# EAGLE schematic mntrg_brd_esc (EAGLE 9.5.1)
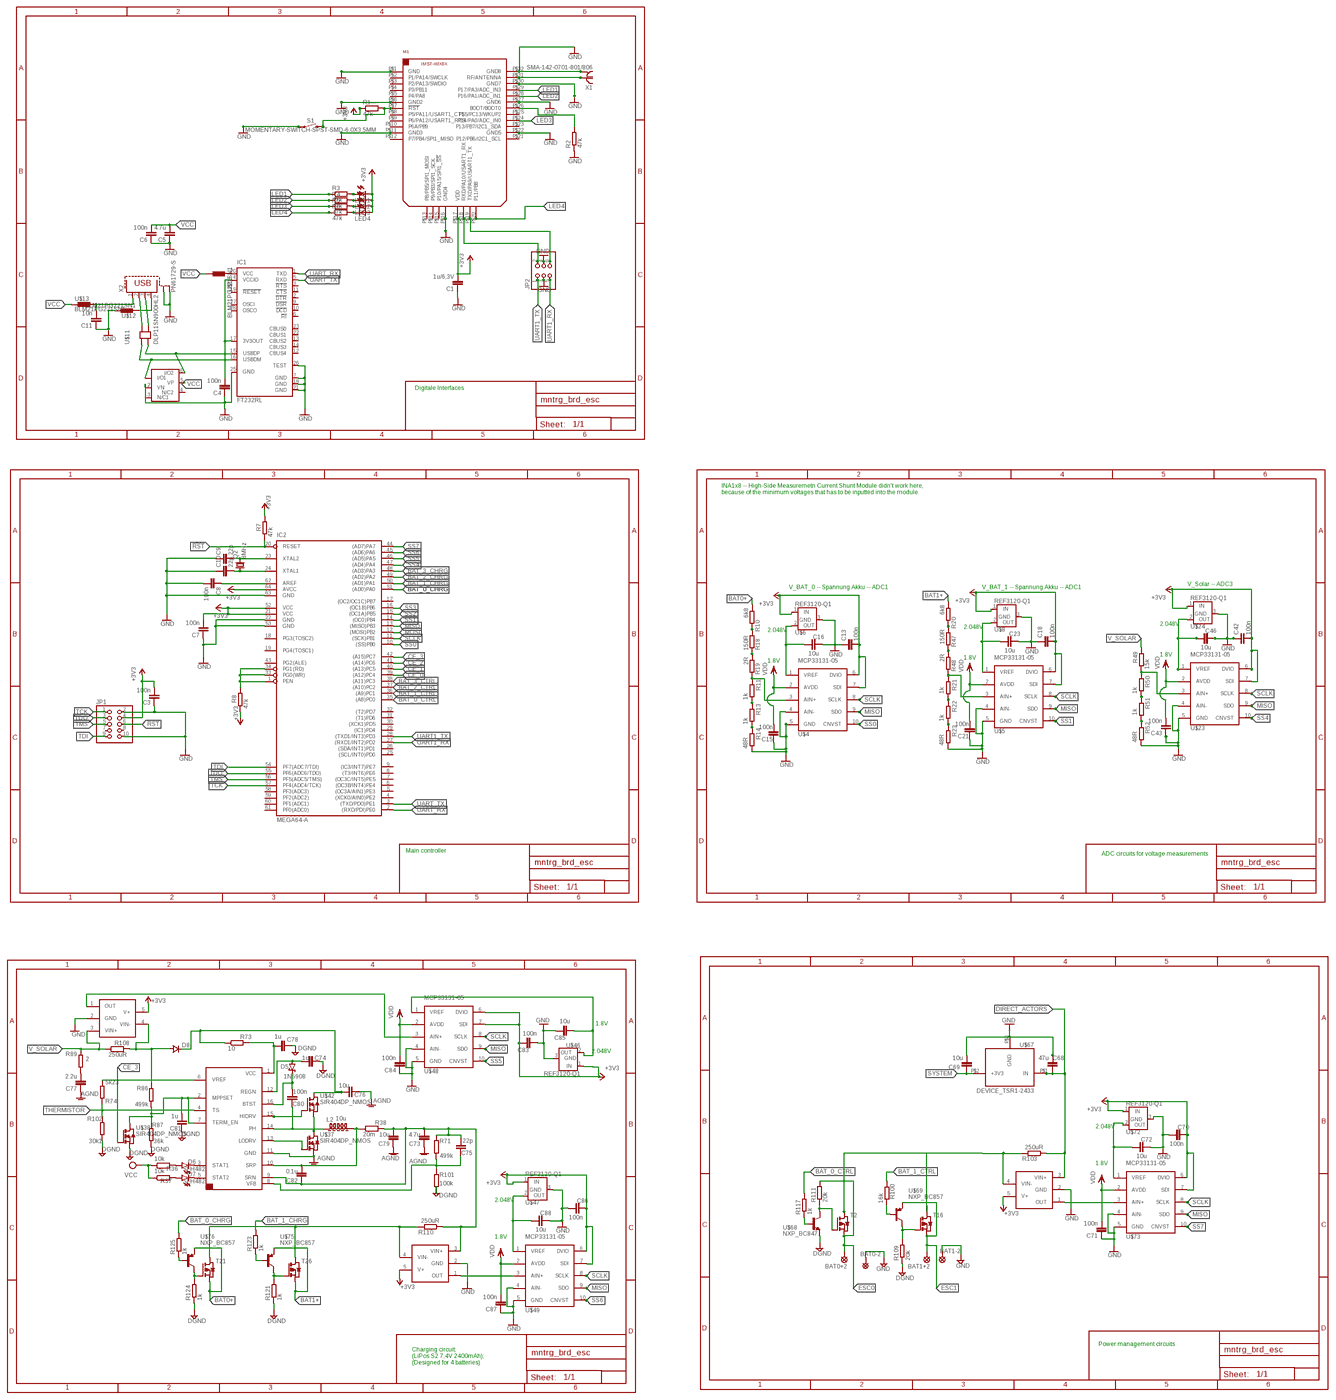
[diagram p0: schematic, sheet 1, overview]
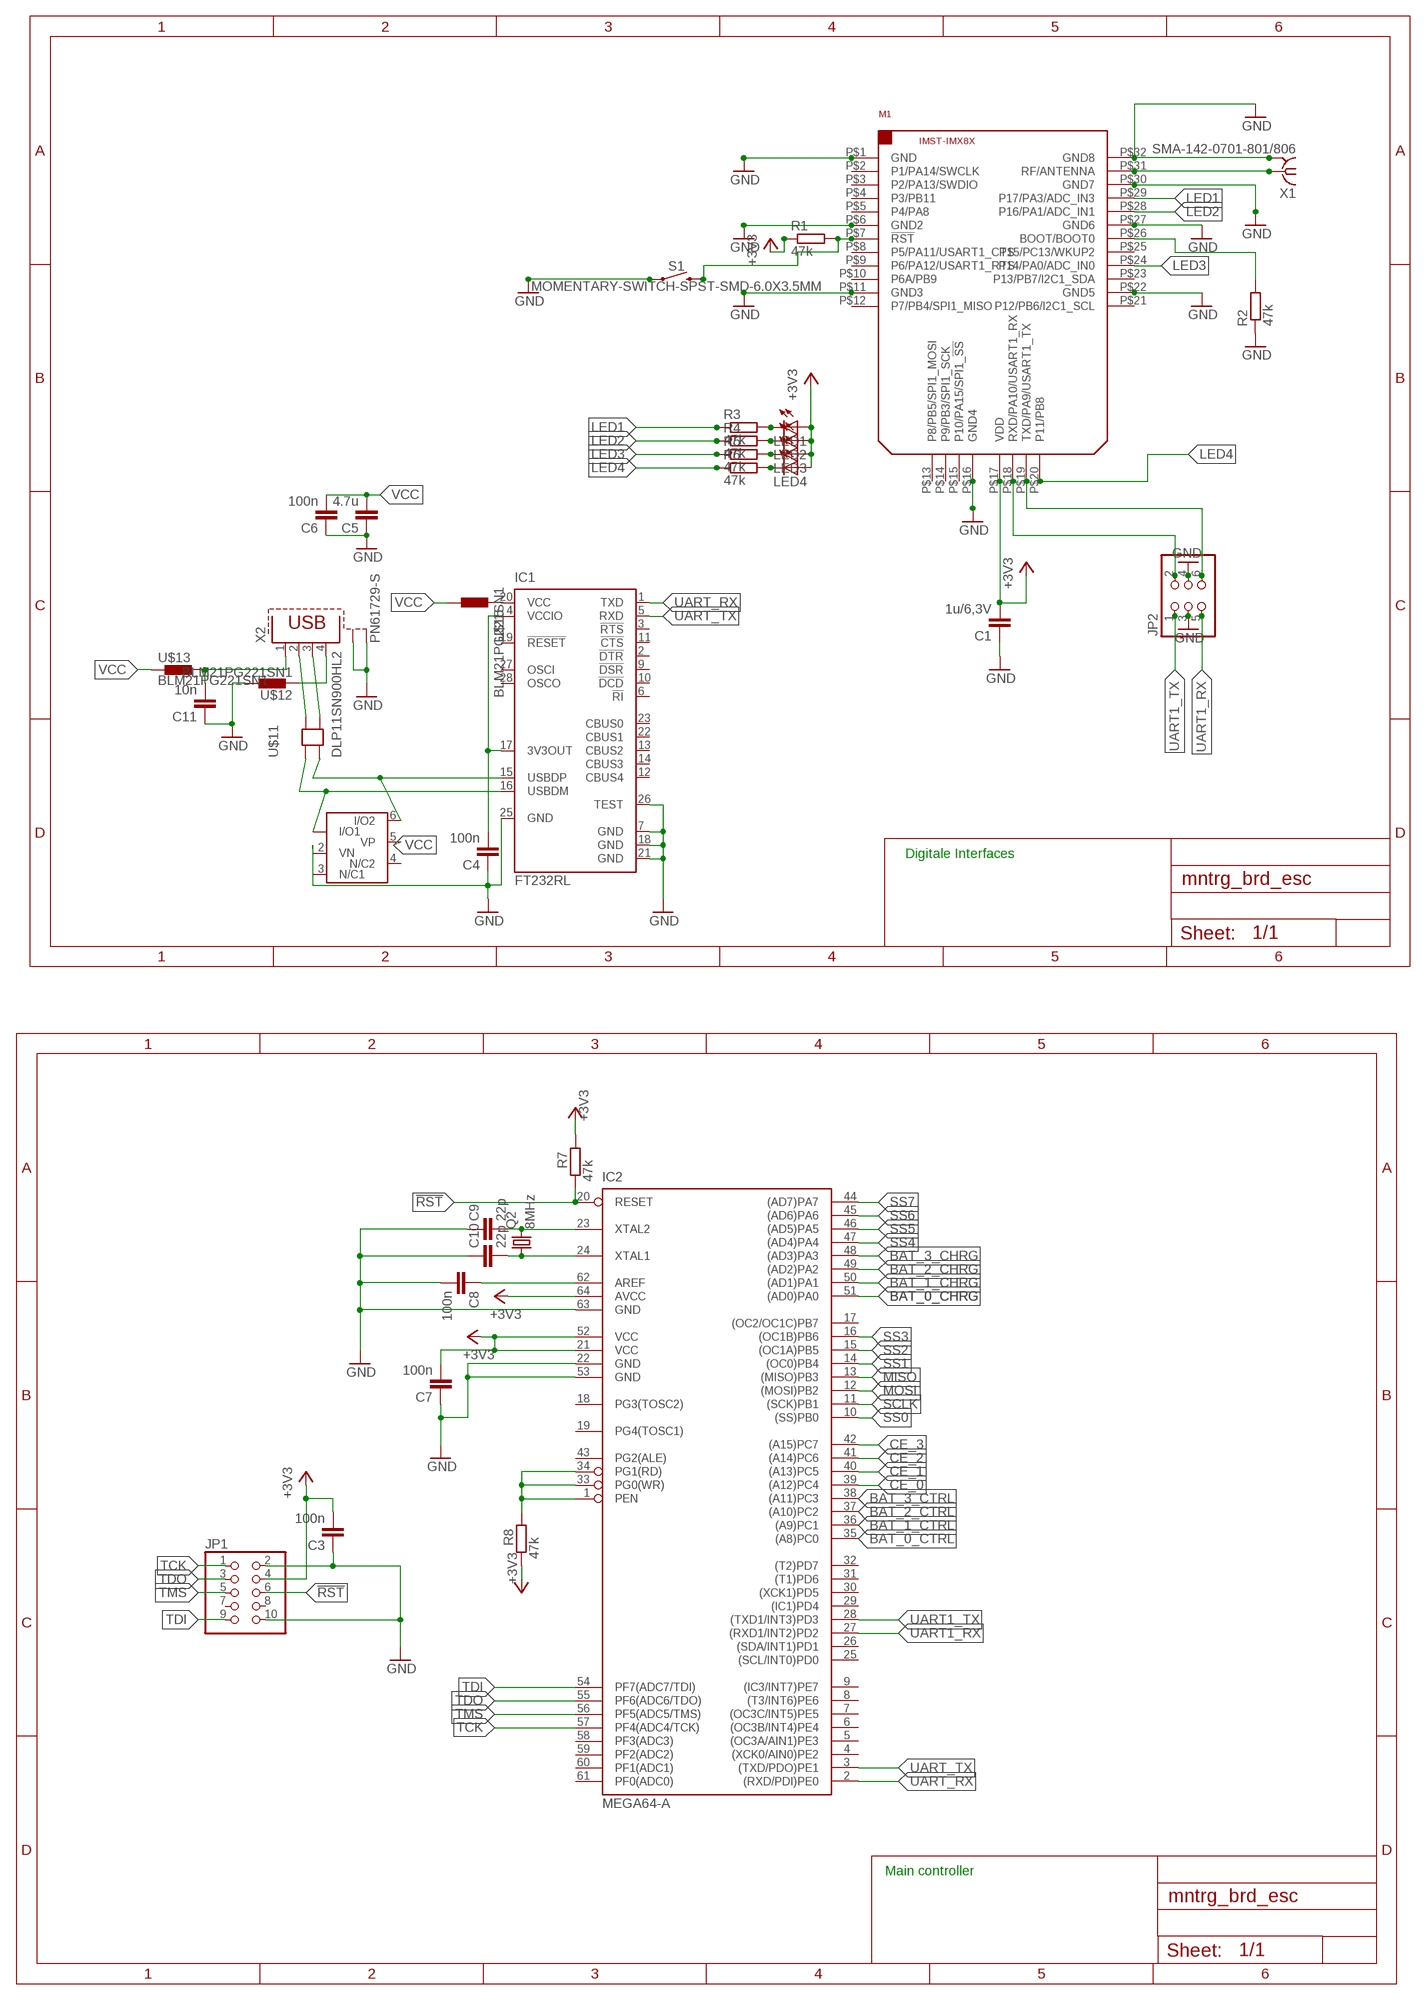
[diagram p1: schematic, sheet 1, part 1 of 4]
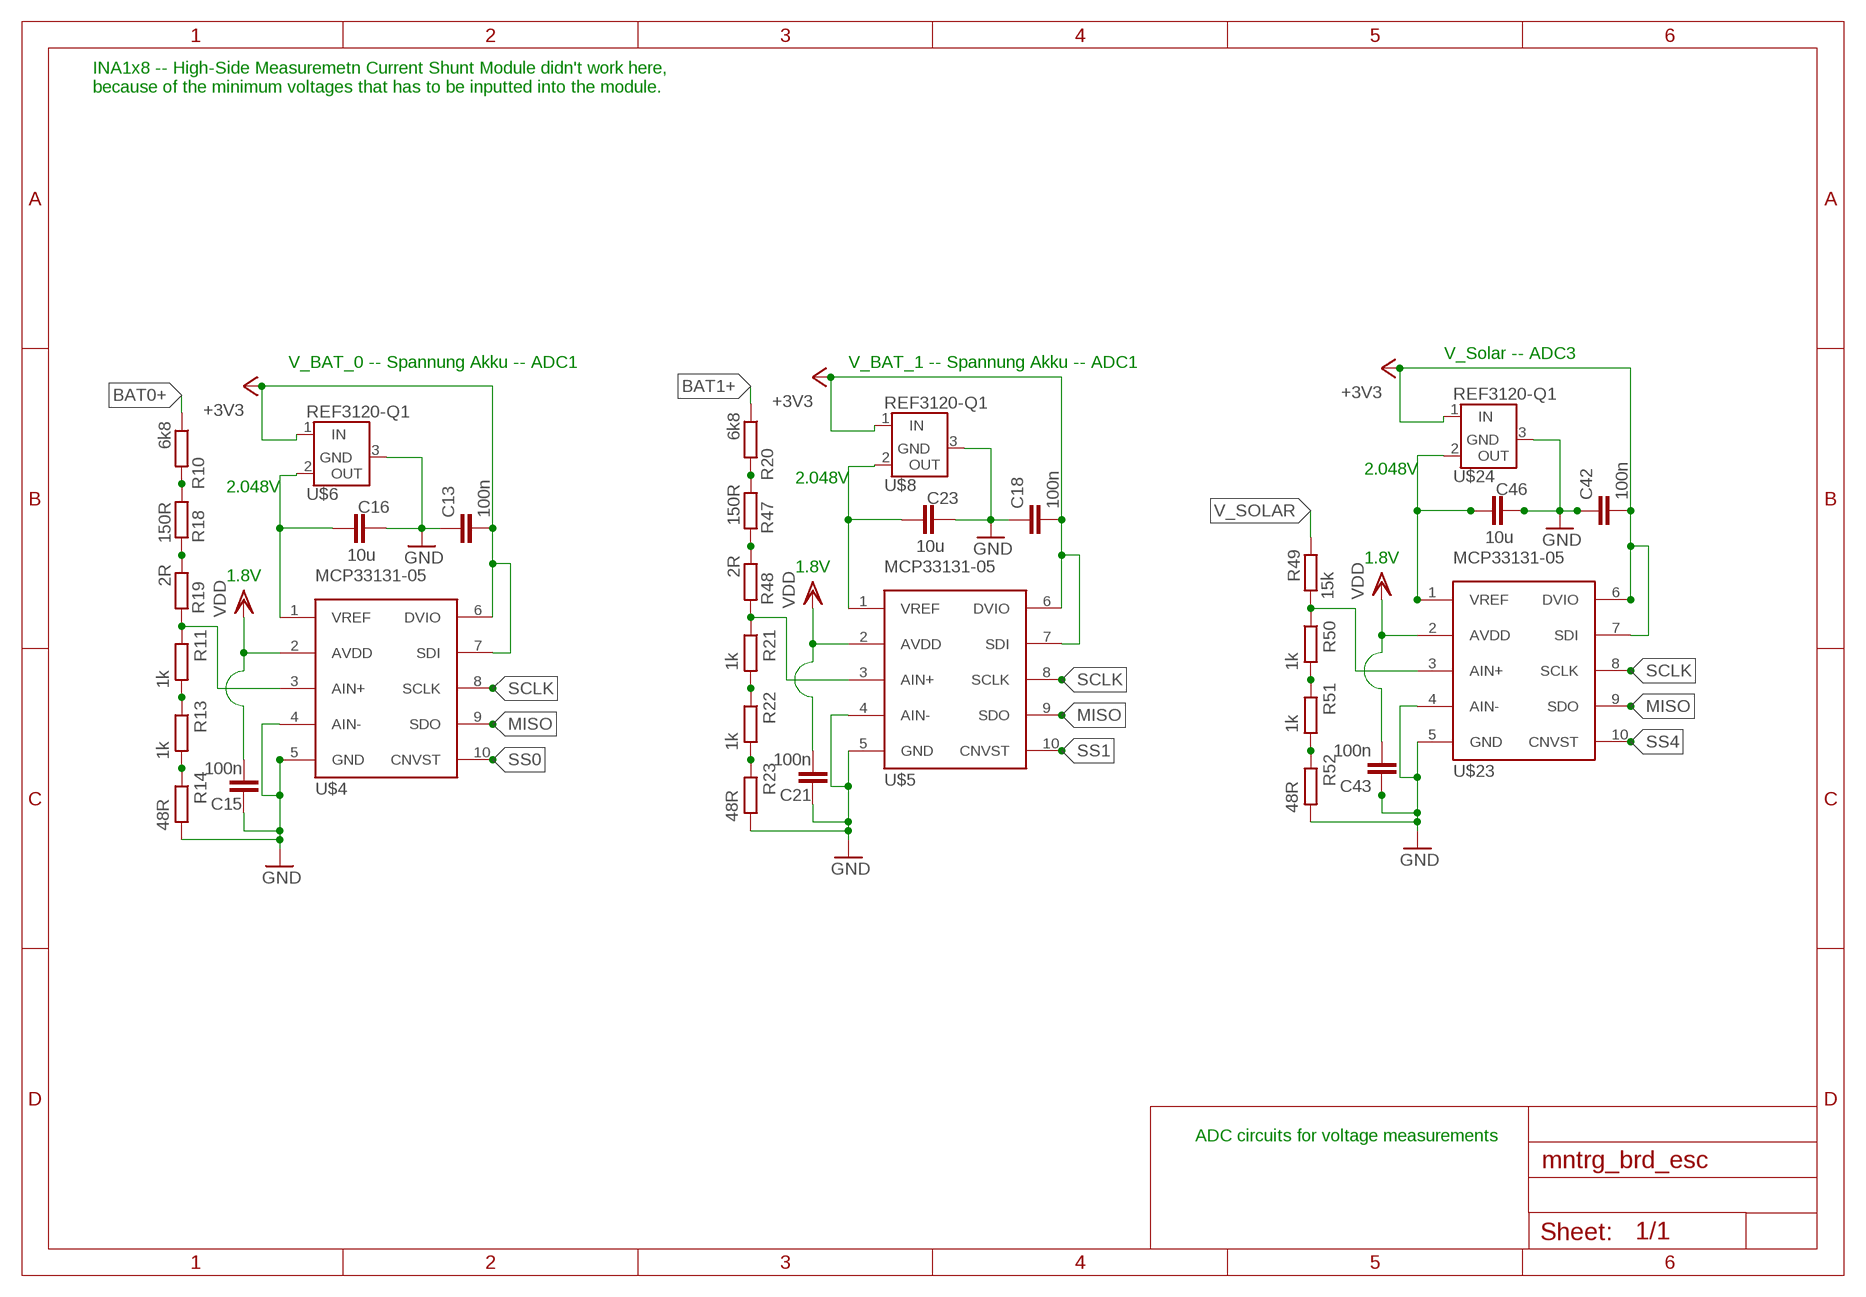
[diagram p2: schematic, sheet 1, part 2 of 4]
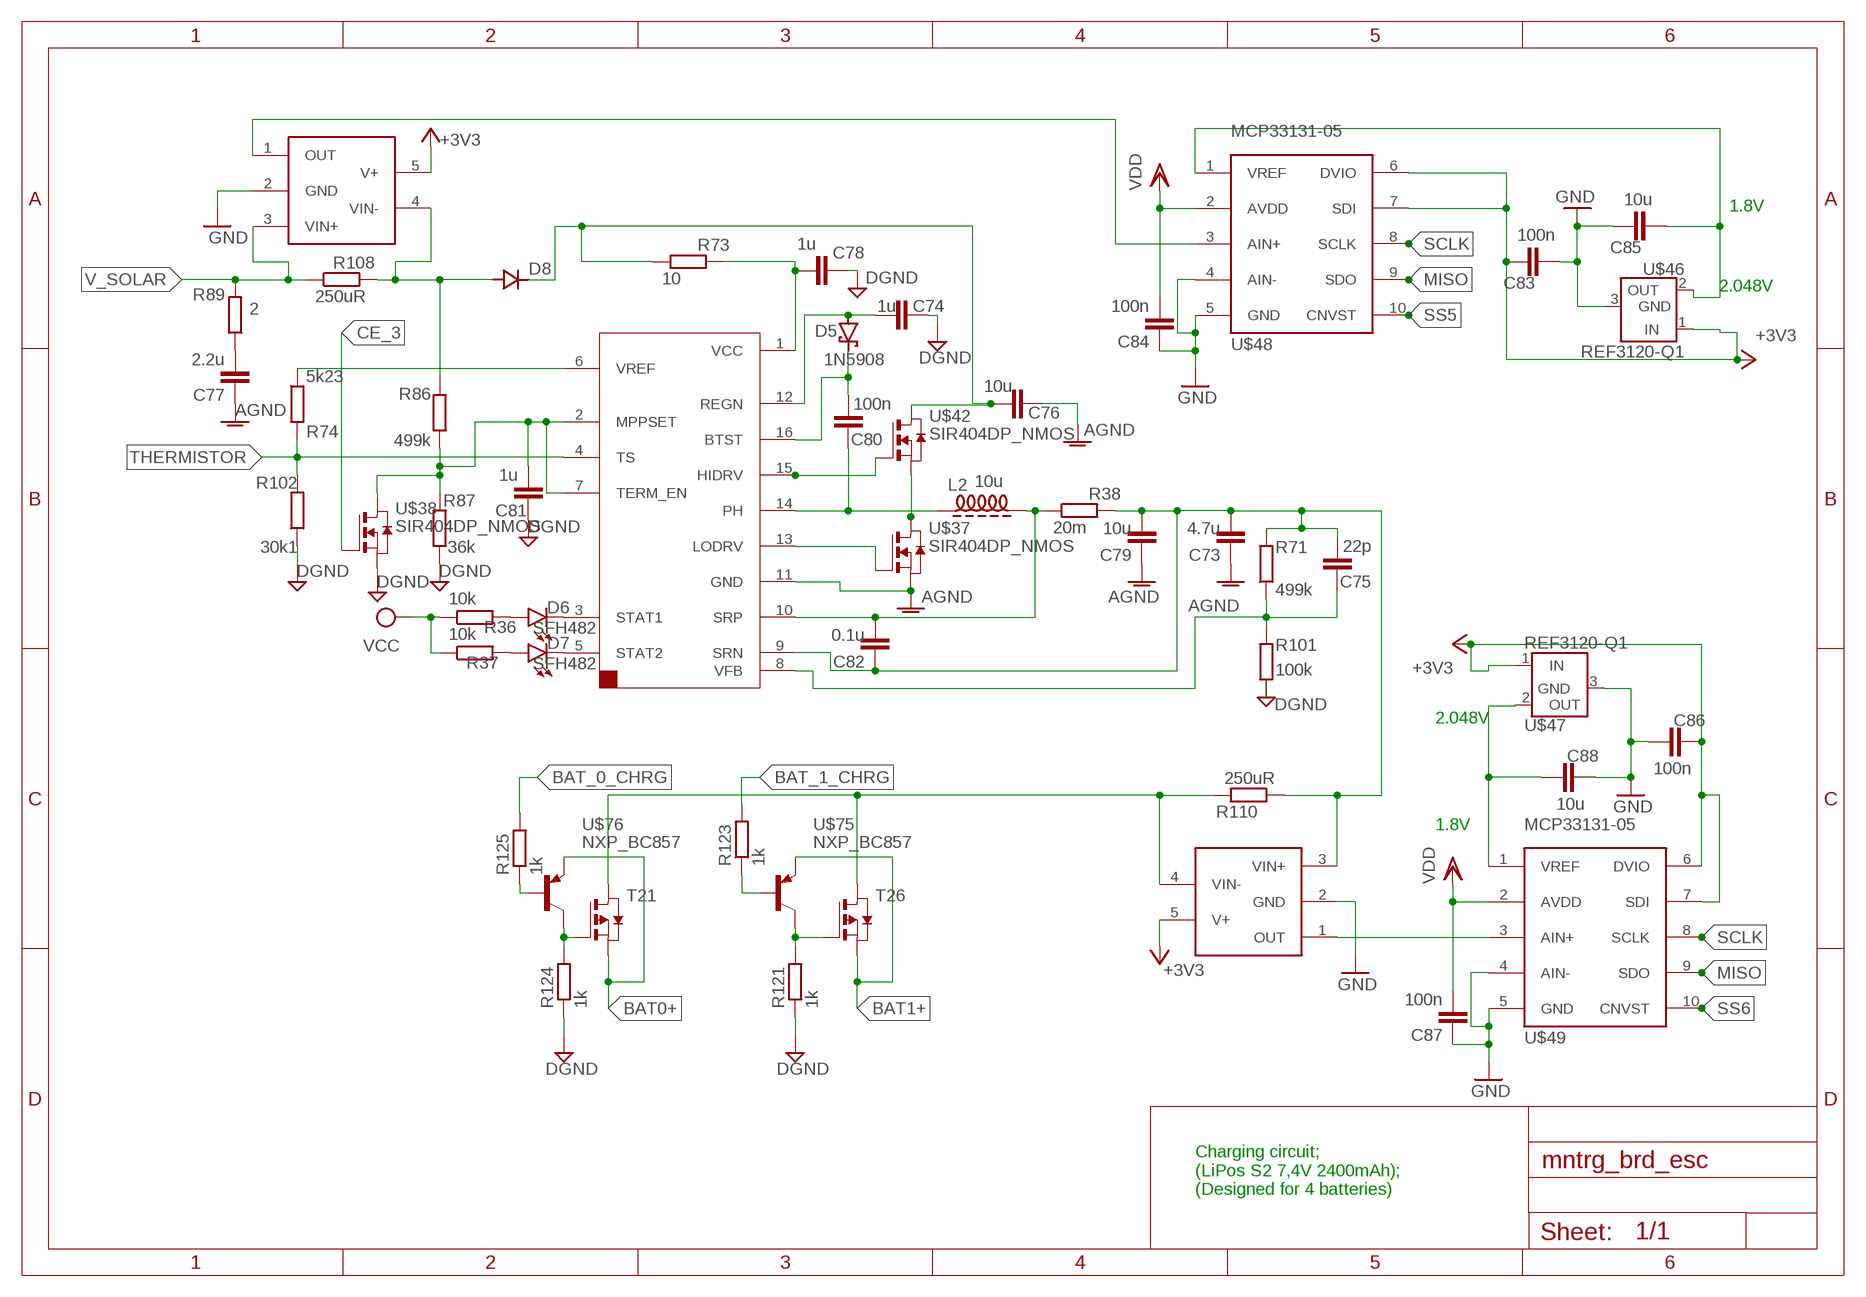
[diagram p3: schematic, sheet 1, part 3 of 4]
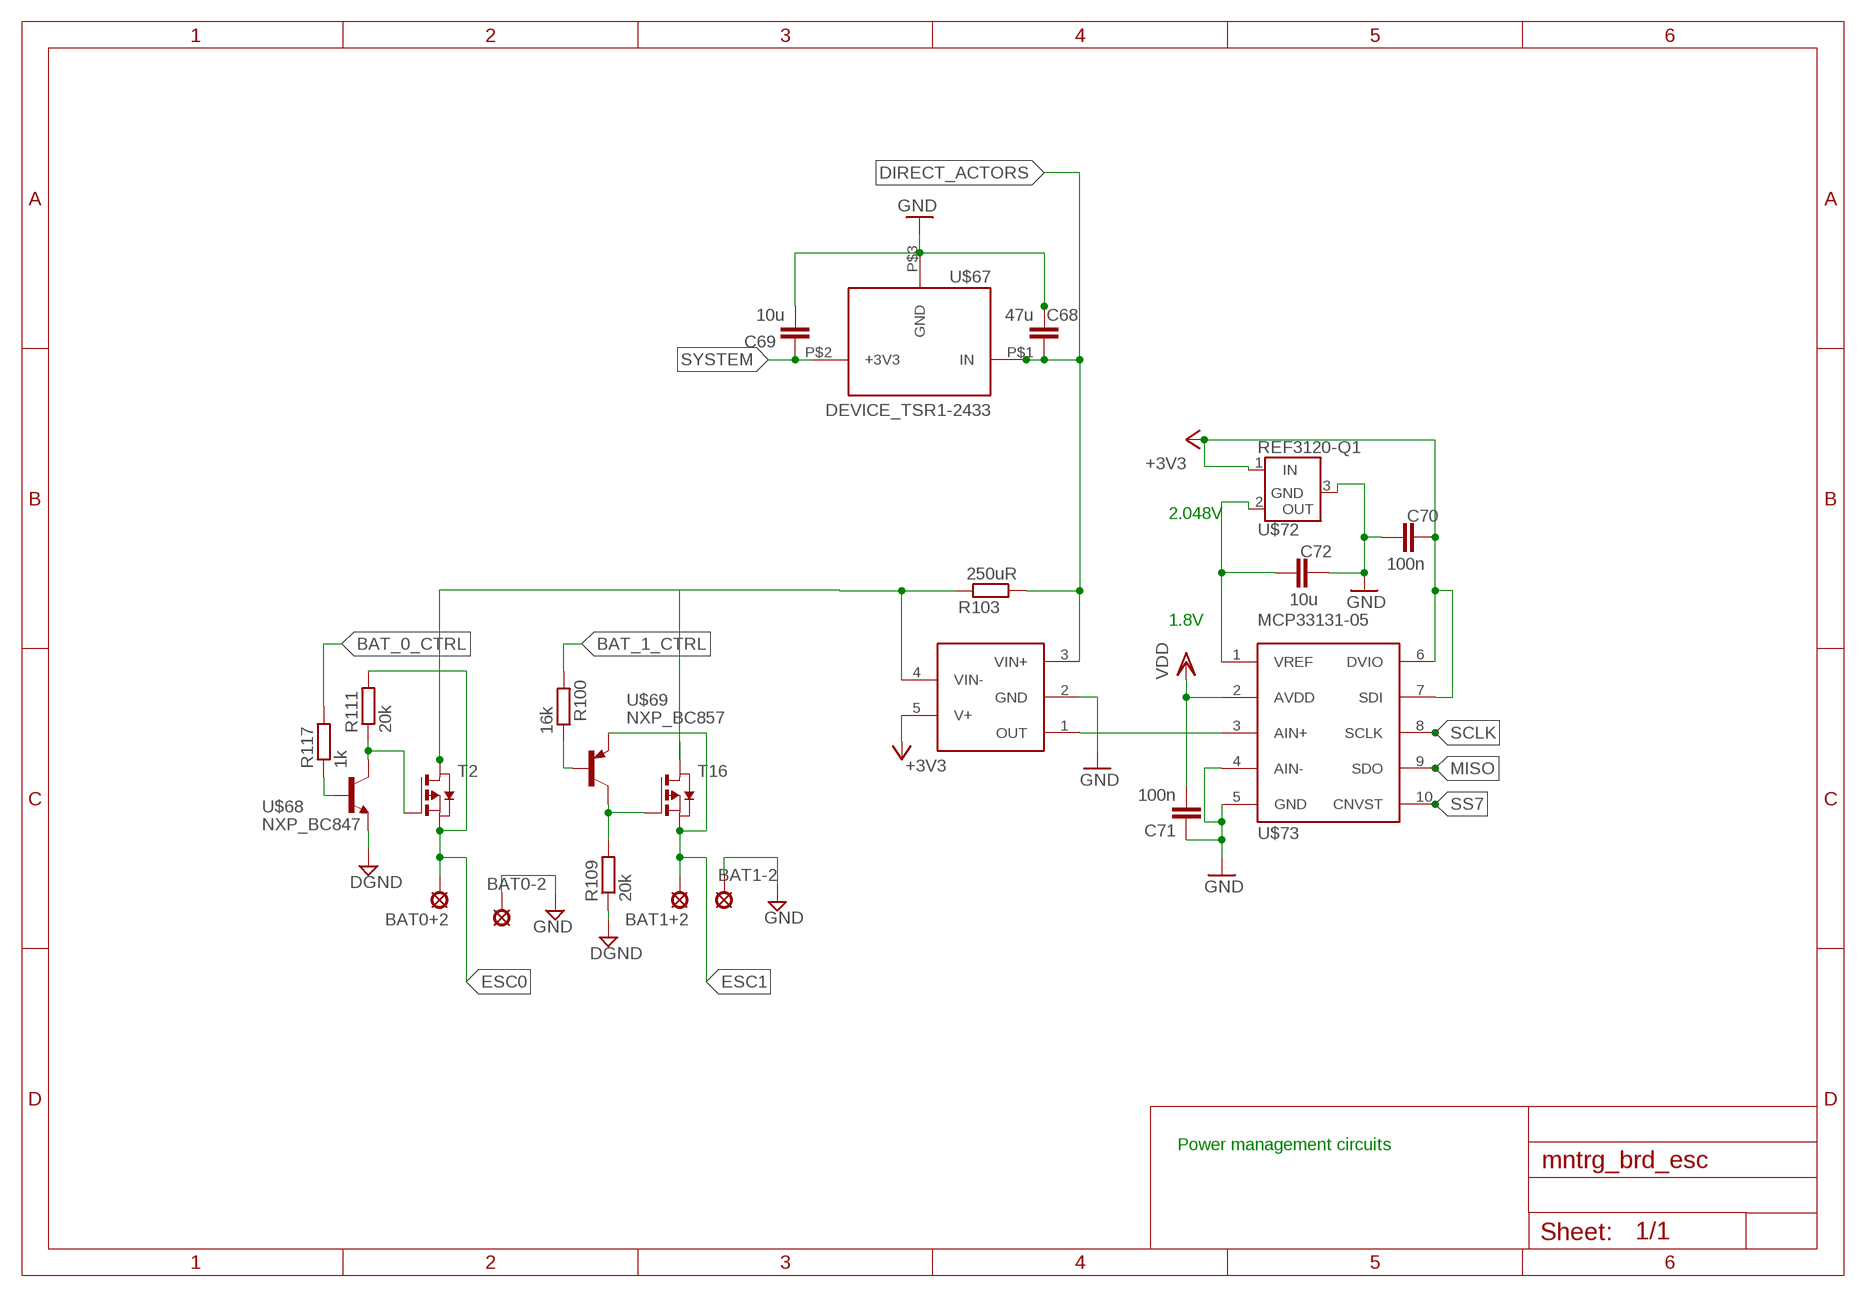
[diagram p4: schematic, sheet 1, part 4 of 4]

## Parts
BAT0+2  SE14  [SE14]
BAT0-2  SE14  [SE14]
BAT1+2  SE14  [SE14]
BAT1-2  SE14  [SE14]
C1  1u/6,3V  C-EUC0603  [C0603]
C3  100n  C-EUC0603  [C0603]
C4  100n  C-EUC0603  [C0603]
C5  4.7u  C-EUC0603  [C0603]
C6  100n  C-EUC0603  [C0603]
C7  100n  C-EUC0603  [C0603]
C8  100n  C-EUC0603  [C0603]
C9  22p  C-EUC0603  [C0603]
C10  22p  C-EUC0603  [C0603]
C11  10n  C-EUC0603  [C0603]
C13  100n  C-EUC0603  [C0603]
C15  100n  C-EUC0603  [C0603]
C16  10u  C-EUC0603  [C0603]
C18  100n  C-EUC0603  [C0603]
C21  100n  C-EUC0603  [C0603]
C23  10u  C-EUC0603  [C0603]
C42  100n  C-EUC0603  [C0603]
C43  100n  C-EUC0603  [C0603]
C46  10u  C-EUC0603  [C0603]
C68  47u  C-EUC1206  [C1206]
C69  10u  C-EUC1206  [C1206]
C70  100n  C-EUC0603  [C0603]
C71  100n  C-EUC0603  [C0603]
C72  10u  C-EUC0603  [C0603]
C73  4.7u  C-EUC0603  [C0603]
C74  1u  C-EUC0603  [C0603]
C75  22p  C-EUC0603  [C0603]
C76  10u  C-EUC0603  [C0603]
C77  2.2u  C-EUC0603  [C0603]
C78  1u  C-EUC0603  [C0603]
C79  10u  C-EUC0603  [C0603]
C80  100n  C-EUC0603  [C0603]
C81  1u  C-EUC0603  [C0603]
C82  0.1u  C-EUC0603  [C0603]
C83  100n  C-EUC0603  [C0603]
C84  100n  C-EUC0603  [C0603]
C85  10u  C-EUC0603  [C0603]
C86  100n  C-EUC0603  [C0603]
C87  100n  C-EUC0603  [C0603]
C88  10u  C-EUC0603  [C0603]
D5  1N5908  [C4111-15]
D6  SFH482  [SFH482]
D7  SFH482  [SFH482]
D8  VAR2SOT23  [SOT-23]
IC1  FT232RL  [SSOP28]
IC2  MEGA64-A  [TQFP64]
JP1  PINHD-2X5  [2X05]
JP2  PINHD-2X3  [2X03]
L2  10u  Z15/10CCW  [Z15/1]
LED1  LEDCHIP-LED0603  [CHIP-LED0603]
LED2  LEDCHIP-LED0603  [CHIP-LED0603]
LED3  LEDCHIP-LED0603  [CHIP-LED0603]
LED4  LEDCHIP-LED0603  [CHIP-LED0603]
M1  IM-X8X  [IM-X8X]
Q2  8MHz  CRYSTALHC49S  [HC49/S]
R1  47k  R-EU_R0603  [R0603]
R2  47k  R-EU_R0603  [R0603]
R3  47k  R-EU_R0603  [R0603]
R4  47k  R-EU_R0603  [R0603]
R5  47k  R-EU_R0603  [R0603]
R6  47k  R-EU_R0603  [R0603]
R7  47k  R-EU_R0603  [R0603]
R8  47k  R-EU_R0603  [R0603]
R10  6k8  R-EU_R0603  [R0603]
R11  1k  R-EU_R0603  [R0603]
R13  1k  R-EU_R0603  [R0603]
R14  48R  R-EU_R0603  [R0603]
R18  150R  R-EU_R0603  [R0603]
R19  2R  R-EU_R0603  [R0603]
R20  6k8  R-EU_R0603  [R0603]
R21  1k  R-EU_R0603  [R0603]
R22  1k  R-EU_R0603  [R0603]
R23  48R  R-EU_R0603  [R0603]
R36  10k  R-EU_R0603  [R0603]
R37  10k  R-EU_R0603  [R0603]
R38  20m  R-EU_R0603  [R0603]
R47  150R  R-EU_R0603  [R0603]
R48  2R  R-EU_R0603  [R0603]
R49  15k  R-EU_R0603  [R0603]
R50  1k  R-EU_R0603  [R0603]
R51  1k  R-EU_R0603  [R0603]
R52  48R  R-EU_R0603  [R0603]
R71  499k  R-EU_R0603  [R0603]
R73  10  R-EU_R0603  [R0603]
R74  5k23  R-EU_R0603  [R0603]
R86  499k  R-EU_R0603  [R0603]
R87  36k  R-EU_R0603  [R0603]
R89  2  R-EU_R0603  [R0603]
R100  16k  R-EU_R0603  [R0603]
R101  100k  R-EU_R0603  [R0603]
R102  30k1  R-EU_R0603  [R0603]
R103  250uR  R-EU_R0603  [R0603]
R108  250uR  R-EU_R0603  [R0603]
R109  20k  R-EU_R0603  [R0603]
R110  250uR  R-EU_R0603  [R0603]
R111  20k  R-EU_R0603  [R0603]
R117  1k  R-EU_R0603  [R0603]
R121  1k  R-EU_R0603  [R0603]
R123  1k  R-EU_R0603  [R0603]
R124  1k  R-EU_R0603  [R0603]
R125  1k  R-EU_R0603  [R0603]
S1  MOMENTARY-SWITCH-SPST-SMD-6.0X3.5MM  [TACTILE_SWITCH_SMD_6.0X3.5MM]
T2  SI7157DP_PMOS  [SI7157DP_PMOS]
T16  SI7157DP_PMOS  [SI7157DP_PMOS]
T21  SI7157DP_PMOS  [SI7157DP_PMOS]
T26  SI7157DP_PMOS  [SI7157DP_PMOS]
U$4  MCP33131-05  [MCP33131-05]
U$5  MCP33131-05  [MCP33131-05]
U$6  REF3120-Q1  [REF3120-Q1]
U$8  REF3120-Q1  [REF3120-Q1]
U$11  DLP11SN900HL2  [DLP11SN900HL2]
U$12  BLM21PG221SN1  [BLM21PG221SN1]
U$13  BLM21PG221SN1  [BLM21PG221SN1]
U$14  DUP2201MR6  [NUP2201MR6]
U$15  BLM21PG221SN1  [BLM21PG221SN1]
U$23  MCP33131-05  [MCP33131-05]
U$24  REF3120-Q1  [REF3120-Q1]
U$36  BQ24650  [BQ24650]
U$37  SIR404DP_NMOS  [SIR404DP_NMOS]
U$38  SIR404DP_NMOS  [SIR404DP_NMOS]
U$42  SIR404DP_NMOS  [SIR404DP_NMOS]
U$46  REF3120-Q1  [REF3120-Q1]
U$47  REF3120-Q1  [REF3120-Q1]
U$48  MCP33131-05  [MCP33131-05]
U$49  MCP33131-05  [MCP33131-05]
U$50  INA138  [INA138]
U$51  INA138  [INA138]
U$67  DEVICE_TSR1-2433  [FOOTPRINT_TSR1-2344]
U$68  NXP_BC847  [NXP_BC847]
U$69  NXP_BC857  [NXP_BC857]
U$72  REF3120-Q1  [REF3120-Q1]
U$73  MCP33131-05  [MCP33131-05]
U$74  INA138  [INA138]
U$75  NXP_BC857  [NXP_BC857]
U$76  NXP_BC857  [NXP_BC857]
X1  SMA-142-0701-801/806  [J502-ND-142-0701-801/806]
X2  PN61729-S  [PN61729-S]

## Nets
!RST: IC2.20(RESET) R7.1
+3V3: C1.2 C3.2 C7.2 C13.2 C18.2 C42.2 C70.2 C83.2 C86.2 IC2.21(VCC) IC2.52(VCC) IC2.64(AVCC) JP1.4 LED1.A LED2.A LED3.A LED4.A M1.P$17(VDD) R1.1 R7.2 R8.1 U$4.6(DVIO) U$4.7(SDI) U$5.6(DVIO) U$5.7(SDI) U$6.1(IN) U$8.1(IN) U$23.6(DVIO) U$23.7(SDI) U$24.1(IN) U$46.1(IN) U$47.1(IN) U$48.6(DVIO) U$48.7(SDI) U$49.6(DVIO) U$49.7(SDI) U$50.5(V+) U$51.5(V+) U$72.1(IN) U$73.6(DVIO) U$73.7(SDI) U$74.5(V+)
AGND: C73.1 C76.1 C77.1 C79.1 U$36.11(GND) U$37.1(S) U$37.2(S) U$37.3(S)
BAT0+: R10.1 T21.1(S) T21.2(S) T21.3(S) U$76.2(E)
BAT1+: R20.1 T26.1(S) T26.2(S) T26.3(S) U$75.2(E)
BAT_0_CHRG: IC2.51((AD0)PA0) R125.2
BAT_0_CTRL: R117.2
BAT_1_CHRG: IC2.50((AD1)PA1) R123.2
BAT_1_CTRL: R100.2
BAT_2_CHRG: IC2.49((AD2)PA2)
BAT_3_CHRG: IC2.48((AD3)PA3)
BATTERY2: C73.2 C75.2 C79.2 C82.1 R38.2 R71.2 R110.1 U$36.9(SRN) U$50.3(VIN+)
CE_0: IC2.39((A12)PC4)
CE_1: IC2.40((A13)PC5)
CE_2: IC2.41((A14)PC6)
CE_3: U$38.4(G)
DGND: C74.1 C78.1 C81.1 R87.1 R101.1 R102.1 R109.1 R121.1 R124.1 U$38.1(S) U$38.2(S) U$38.3(S) U$68.2(E)
DIRECT_ACTORS: C68.1 R103.1 U$67.P$1(IN) U$74.3(VIN+)
ESC0: BAT0+2.MP R111.2 T2.1(S) T2.2(S) T2.3(S)
ESC1: BAT1+2.MP T16.1(S) T16.2(S) T16.3(S) U$69.2(E)
GND: BAT0-2.MP BAT1-2.MP C1.1 C3.1 C4.1 C5.1 C6.1 C7.1 C8.2 C9.1 C10.1 C11.1 C13.1 C15.1 C16.2 C18.1 C21.1 C23.2 C42.1 C46.2 C68.2 C69.2 C70.1 C71.1 C72.2 C83.1 C84.1 C85.2 C86.1 C87.1 C88.2 IC1.7(GND) IC1.18(GND) IC1.21(GND) IC1.25(GND) IC1.26(TEST) IC2.22(GND) IC2.53(GND) IC2.63(GND) JP1.2 JP1.10 JP2.3 JP2.4 M1.P$1(GND) M1.P$6(GND2) M1.P$11(GND3) M1.P$16(GND4) M1.P$22(GND5) M1.P$27(GND6) M1.P$30(GND7) M1.P$32(GND8) R2.1 R14.2 R23.2 S1.1 U$4.4(AIN-) U$4.5(GND) U$5.4(AIN-) U$5.5(GND) U$6.3(GND) U$8.3(GND) U$12.2 U$14.2(VN) U$24.3(GND) U$46.3(GND) U$47.3(GND) U$48.4(AIN-) U$48.5(GND) U$49.4(AIN-) U$49.5(GND) U$50.2(GND) U$51.2(GND) U$67.P$3(GND) U$72.3(GND) U$73.4(AIN-) U$73.5(GND) U$74.2(GND) X1.G@1 X1.G@2 X1.G@3 X1.G@4 X2.S1 X2.S2
GND1: C43.1 R52.2 U$23.4(AIN-) U$23.5(GND) ; supply symbol labelled GND
LED1: M1.P$29(P17/PA3/ADC_IN3) R3.1
LED2: M1.P$28(P16/PA1/ADC_IN1) R4.1
LED3: M1.P$24(P14/PA0/ADC_IN0) R5.1
LED4: M1.P$20(P11/PB8) R6.1
MISO: IC2.13((MISO)PB3) U$4.9(SDO) U$5.9(SDO) U$23.9(SDO) U$48.9(SDO) U$49.9(SDO) U$73.9(SDO)
MOSI: IC2.12((MOSI)PB2)
N$1: M1.P$31(RF/ANTENNA) X1.1
N$2: LED1.C R3.2
N$3: M1.P$7(!RST) R1.2 S1.2
N$4: M1.P$26(BOOT/BOOT0) R2.2
N$5: LED2.C R4.2
N$6: LED3.C R5.2
N$7: LED4.C R6.2
N$8: IC2.54(PF7(ADC7/TDI))
N$9: IC2.55(PF6(ADC6/TDO))
N$10: IC2.56(PF5(ADC5/TMS))
N$11: IC2.57(PF4(ADC4/TCK))
N$12: C9.2 IC2.23(XTAL2) Q2.2
N$13: C10.2 IC2.24(XTAL1) Q2.1
N$14: C8.1 IC2.62(AREF)
N$15: JP1.6
N$16: IC2.1(PEN) IC2.33(PG0(WR)) IC2.34(PG1(RD)) R8.2
N$17: U$11.2 X2.2
N$18: U$11.4 X2.3
N$19: IC1.16(USBDM) U$11.1 U$14.1(I/O1)
N$20: IC1.15(USBDP) U$11.3 U$14.6(I/O2)
N$21: U$12.1 X2.4
N$22: C16.1 U$4.1(VREF) U$6.2(OUT)
N$23: R11.1 R19.2 U$4.3(AIN+)
N$24: R13.2 R14.1
N$25: C4.2 IC1.4(VCCIO) IC1.17(3V3OUT)
N$26: R11.2 R13.1
N$27: R10.2 R18.1
N$30: C11.2 U$13.2 X2.1
N$34: R18.2 R19.1
N$35: C23.1 U$5.1(VREF) U$8.2(OUT)
N$39: R21.1 R48.2 U$5.3(AIN+)
N$40: R22.2 R23.1
N$41: R21.2 R22.1
N$42: R20.2 R47.1
N$43: R47.2 R48.1
N$49: IC2.42((A15)PC7)
N$50: C77.2 R89.1
N$54: R74.1 U$36.6(VREF)
N$55: C81.2 R86.1 R87.2 U$36.2(MPPSET) U$36.7(TERM_EN)
N$73: D6.K(C) U$36.3(STAT1)
N$74: D7.K(C) U$36.5(STAT2)
N$75: D6.A R36.2
N$76: D7.A R37.2
N$86: C46.1 U$23.1(VREF) U$24.2(OUT)
N$91: R49.1 R50.1 U$23.3(AIN+)
N$95: R51.2 R52.1
N$96: R50.2 R51.1
N$112: C78.2 R73.2 U$36.1(VCC)
N$114: C74.2 D5.A U$36.12(REGN)
N$115: C80.1 L2.1 U$36.14(PH)
N$132: U$36.13(LODRV)
N$133: C82.2 L2.2 R38.1 U$36.10(SRP)
N$135: C80.2 D5.C U$36.16(BTST)
N$152: U$36.15(HIDRV) U$42.4(G)
N$153: C76.2 D8.1(C) R73.1 U$42.5(D) U$42.6(D) U$42.7(D) U$42.8(D)
N$154: C75.1 R71.1 R101.2 U$36.8(VFB)
N$164: C72.1 U$72.2(OUT) U$73.1(VREF)
N$165: U$73.3(AIN+) U$74.1(OUT)
N$166: R103.2 T2.5(D) T2.6(D) T2.7(D) T2.8(D) T16.5(D) T16.6(D) T16.7(D) T16.8(D) U$74.4(VIN-)
N$167: R111.1 T2.4(G) U$68.3(C)
N$168: R117.1 U$68.1(B)
N$169: R109.2 T16.4(G) U$69.3(C)
N$172: D8.3(A) R86.2 R108.2 U$51.4(VIN-)
N$173: U$38.5(D) U$38.6(D) U$38.7(D) U$38.8(D)
N$174: U$37.5(D) U$37.6(D) U$37.7(D) U$37.8(D) U$42.1(S) U$42.2(S) U$42.3(S)
N$176: U$37.4(G)
N$179: R100.1 U$69.1(B)
N$184: C88.1 U$47.2(OUT) U$49.1(VREF)
N$185: R110.2 T21.5(D) T21.6(D) T21.7(D) T21.8(D) T26.5(D) T26.6(D) T26.7(D) T26.8(D) U$50.4(VIN-)
N$186: U$49.3(AIN+) U$50.1(OUT)
N$189: C85.1 U$46.2(OUT) U$48.1(VREF)
N$190: U$48.3(AIN+) U$51.1(OUT)
N$191: R124.2 T21.4(G) U$76.3(C)
N$192: R125.1 U$76.1(B)
N$193: R121.2 T26.4(G) U$75.3(C)
N$194: R123.1 U$75.1(B)
SCLK: IC2.11((SCK)PB1) U$4.8(SCLK) U$5.8(SCLK) U$23.8(SCLK) U$48.8(SCLK) U$49.8(SCLK) U$73.8(SCLK)
SS0: IC2.10((SS)PB0) U$4.10(CNVST)
SS1: IC2.14((OC0)PB4) U$5.10(CNVST)
SS2: IC2.15((OC1A)PB5)
SS3: IC2.16((OC1B)PB6)
SS4: IC2.47((AD4)PA4) U$23.10(CNVST)
SS5: IC2.46((AD5)PA5) U$48.10(CNVST)
SS6: IC2.45((AD6)PA6) U$49.10(CNVST)
SS7: IC2.44((AD7)PA7) U$73.10(CNVST)
SYSTEM: C69.1 U$67.P$2(+3V3)
TCK: JP1.1
TDI: JP1.9
TDO: JP1.3
THERMISTOR: R74.2 R102.2 U$36.4(TS)
TMS: JP1.5
UART1_RX: IC2.27((RXD1/INT2)PD2) JP2.5 JP2.6 M1.P$19(TXD/PA9/USART1_TX)
UART1_TX: IC2.28((TXD1/INT3)PD3) JP2.1 JP2.2 M1.P$18(RXD/PA10/USART1_RX)
UART_RX: IC1.1(TXD) IC2.2((RXD/PDI)PE0)
UART_TX: IC1.5(RXD) IC2.3((TXD/PDO)PE1)
V_SOLAR: R49.2 R89.2 R108.1 U$51.3(VIN+)
VCC: C5.2 C6.2 IC1.20(VCC) R36.1 R37.1 U$13.1 U$14.5(VP) U$15.1 U$15.2
VDD: C15.2 C21.2 C43.2 C71.2 C84.2 C87.2 U$4.2(AVDD) U$5.2(AVDD) U$23.2(AVDD) U$48.2(AVDD) U$49.2(AVDD) U$73.2(AVDD)
Unconnected: IC1.2(!DTR) IC1.3(!RTS) IC1.6(!RI) IC1.9(!DSR) IC1.10(!DCD) IC1.11(!CTS) IC1.12(CBUS4) IC1.13(CBUS2) IC1.14(CBUS3) IC1.19(!RESET) IC1.22(CBUS1) IC1.23(CBUS0) IC1.27(OSCI) IC1.28(OSCO) IC2.4((XCK0/AIN0)PE2) IC2.5((OC3A/AIN1)PE3) IC2.6((OC3B/INT4)PE4) IC2.7((OC3C/INT5)PE5) IC2.8((T3/INT6)PE6) IC2.9((IC3/INT7)PE7) IC2.17((OC2/OC1C)PB7) IC2.18(PG3(TOSC2)) IC2.19(PG4(TOSC1)) IC2.25((SCL/INT0)PD0) IC2.26((SDA/INT1)PD1) IC2.29((IC1)PD4) IC2.30((XCK1)PD5) IC2.31((T1)PD6) IC2.32((T2)PD7) IC2.35((A8)PC0) IC2.36((A9)PC1) IC2.37((A10)PC2) IC2.38((A11)PC3) IC2.43(PG2(ALE)) IC2.58(PF3(ADC3)) IC2.59(PF2(ADC2)) IC2.60(PF1(ADC1)) IC2.61(PF0(ADC0)) JP1.7 JP1.8 M1.P$2(P1/PA14/SWCLK) M1.P$3(P2/PA13/SWDIO) M1.P$4(P3/PB11) M1.P$5(P4/PA8) M1.P$8(P5/PA11/USART1_CTS) M1.P$9(P6/PA12/USART1_RTS) M1.P$10(P6A/PB9) M1.P$12(P7/PB4/SPI1_MISO) M1.P$13(P8/PB5/SPI1_MOSI) M1.P$14(P9/PB3/SPI1_SCK) M1.P$15(P10/PA15/SPI1_!SS) M1.P$21(P12/PB6/I2C1_SCL) M1.P$23(P13/PB7/I2C1_SDA) M1.P$25(P15/PC13/WKUP2) U$14.3(N/C1) U$14.4(N/C2)

## Notes on the sheet
- Digitale Interfaces
- INA1x8 -- High-Side Measuremetn Current Shunt Module didn't work here,
  because of the minimum voltages that has to be inputted into the module.
- V_Solar -- ADC3
- V_BAT_0 -- Spannung Akku -- ADC1 | V_BAT_1 -- Spannung Akku -- ADC1
- 2.048V
- 2.048V
- 2.048V
- 1.8V
- 1.8V
- 1.8V
- Main controller
- ADC circuits for voltage measurements
- 1.8V
- 2.048V
- 2.048V
- 1.8V
- 2.048V
- 1.8V
- Power management circuits
- Charging circuit;
  (LiPos S2 7,4V 2400mAh);
  (Designed for 4 batteries)

## Library data of the parts
BAT0+2 BAT0-2 BAT1+2 BAT1-2 = solpad:SE14: SOLDER PAD E1553, drill 1,4mm, distributor Buerklin, 07F820
C1 C3-C11 C13 C15 C16 C18 C21 C23 C42 C43 C46 C70-C88 = resistor:C-EU: CAPACITOR, European symbol
C68 C69 = rcl:C-EU: CAPACITOR, European symbol; SPICEPREFIX: C
D5 = diode:1N5908: DIODE schottky
D6 D7 = led:SFH482: IR LED infrared emitting diode, Infineon
D8 = zetex:VAR2SOT23: DIODE; OC_FARNELL: unknown; OC_NEWARK: unknown
IC1 = ftdichip:FT232R: Source: http://www.ftdichip.com/Documents/DataSheets/DS_FT232R_v104.pdf; MPN: FT232RL; OC_FARNELL: 1146032; OC_NEWARK: 91K9918
IC2 = atmel:MEGA64: MICROCONTROLLER 64 Kbytes FLASH 4 Kbytes SRAM 2 Kbytes EEPROM DUAL USART 8-channel 10 bit ADC Source: avr.lbr; MPN: ATMEGA64-16AU; OC_FARNELL: 9171355; OC_NEWARK: 01M6899
JP1 = pinhead:PINHD-2X5: PIN HEADER
JP2 = pinhead:PINHD-2X3: PIN HEADER
L2 = inductor-neosid:Z?CCW: CHOKE free-suspension choke/nominal inductance winding counter clockwise; OC_FARNELL: unknown; OC_NEWARK: unknown
LED1-LED4 = led:LED: LED OSRAM: - CHIPLED LG R971, LG N971, LY N971, LG Q971, LY Q971, LO R971, LY R971 LH N974, LH R974 LS Q976, LO Q976, LY Q976 LO Q996 - Hyper CHIPLED LW Q18S LB Q993, LB Q99A, LB R99A - SideLED LS A670, LO A670, LY A670, LG A670, LP A670 LB A673, LV A673, LT A673, LW A673 LH A674 LY A675 LS A676, LA A676, LO A676, LY A676, LW A676 LS A679, LY A679, LG A679 - Hyper Micro SIDELED® LS Y876, LA Y876, LO Y876, LY Y876 LT Y87S - SmartLED LW L88C, LW L88S LB L89C, LB L89S, LG L890 LS L89K, LO L89K, LY L89K LS L896, LA L896, LO L896, LY L896 - TOPLED LS T670, LO T670, LY T670, LG T670, LP T670 LSG T670, LSP T670, LSY T670, LOP T670, LYG T670 LG T671, LOG T671, LSG T671 LB T673, LV T673, LT T673, LW T673 LH T674 LS T676, LA T676, LO T676, LY T676, LB T676, LH T676, LSB T676, LW T676 LB T67C, LV T67C, LT T67C, LS T67K, LO T67K, LY T67K, LW E67C LS E67B, LA E67B, LO E67B, LY E67B, LB E67C, LV E67C, LT E67C LW T67C LS T679, LY T679, LG T679 LS T770, LO T770, LY T770, LG T770, LP T770 LB T773, LV T773, LT T773, LW T773 LH T774 LS E675, LA E675, LY E675, LS T675 LS T776, LA T776, LO T776, LY T776, LB T776 LHGB T686 LT T68C, LB T68C - Hyper Mini TOPLED® LB M676 - Mini TOPLED Santana® LG M470 LS M47K, LO M47K, LY M47K Source: http://www.osram.convergy.de LUXEON: - LUMILED® LXK2-PW12-R00, LXK2-PW12-S00, LXK2-PW14-U00, LXK2-PW14-V00 LXK2-PM12-R00, LXK2-PM12-S00, LXK2-PM14-U00 LXK2-PE12-Q00, LXK2-PE12-R00, LXK2-PE12-S00, LXK2-PE14-T00, LXK2-PE14-U00 LXK2-PB12-K00, LXK2-PB12-L00, LXK2-PB12-M00, LXK2-PB14-N00, LXK2-PB14-P00, LXK2-PB14-Q00 LXK2-PR12-L00, LXK2-PR12-M00, LXK2-PR14-Q00, LXK2-PR14-R00 LXK2-PD12-Q00, LXK2-PD12-R00, LXK2-PD12-S00 LXK2-PH12-R00, LXK2-PH12-S00 LXK2-PL12-P00, LXK2-PL12-Q00, LXK2-PL12-R00 Source: www.luxeon.com KINGBRIGHT: KA-3528ASYC Source: www.kingbright.com
M1 = IMST:IM-X8X: The iM881Ais a compact, low power, bidirectional radio module for the 868MHz frequency bandusing Semtech’s LoRaTMmodulation technology. The module provides ultra-long range spread spectrumcommunication and high interference immunity whilstminimising current consumption. Using the iM881Ain an application minimizes the need for an expensive and time-consuming RF development. Fast time to market is possible with this pre-qualified module.The iM881Aprovides an optimized RF performance for the extreme temperature range In addition, the iM881Ais optimized for battery driven application and is equipped with apowerful STM32L051 controller.
Q2 = crystal:CRYSTAL: CRYSTAL; OC_FARNELL: 1667008; OC_NEWARK: unknown
R1-R8 R10 R11 R13 R14 R18-R23 R36-R38 R47-R52 R71 R73 R74 R86 R87 R89 R100-R103 R108 R110 = rcl:R-EU_: RESISTOR, European symbol
R109 R111 R117 R121 R123-R125 = rcl:R-EU_: RESISTOR, European symbol; SPICEPREFIX: R
S1 = SparkFun-Switches:MOMENTARY-SWITCH-SPST: Momentary Switch (Pushbutton) - SPST Normally-open (NO) SPST momentary switches (buttons, pushbuttons). Variants PTH-12MM - 12mm square, through-hole Momentary Pushbutton Switch - 12mm Square <https://www.sparkfun.com/products/9190> (COM-09190) PTH-6.0MM, PTH-6.0MM-KIT - 6.0mm square, through-hole Mini Pushbutton Switch <https://www.sparkfun.com/products/97> (COM-00097) KIT package intended for soldering kit's - only one side of pads' copper is exposed. PTH-RIGHT-ANGLE-KIT - Right-angle, through-hole Right Angle Tactile Button <https://www.sparkfun.com/products/10791> - Used on SparkFun BigTime Watch Kit <https://www.sparkfun.com/products/11734> SMD-12MM - 12mm square, surface-mount Tactile Button - SMD (12mm) <https://www.sparkfun.com/products/12993> (COM-12993) Used on SparkFun PicoBoard <https://www.sparkfun.com/products/11888> SMD-4.5MM - 4.5mm Square Trackball Switch Used on SparkFun Blackberry Trackballer Breakout <https://www.sparkfun.com/products/13169> SMD-4.6MMX2.8MM - 4.60mm x 2.80mm, surface mount Used on SparkFun SAMD21 Mini Breakout <https://www.sparkfun.com/products/13664> SMD-5.2MM, SMD-5.2-REDUNDANT - 5.2mm square, surface-mount Mini Pushbutton Switch - SMD <https://www.sparkfun.com/products/8720> (COM-08720) Used on Arduino Pro Mini <https://www.sparkfun.com/products/11114> REDUNDANT package connects both switch circuits together SMD-6.0X3.5MM - 6.0 x 3.5mm, surface mount Momentary Reset Switch SMD <https://www.sparkfun.com/products/8229> (COM-08229) SMD-6.2MM-TALL - 6.2mm square, surface mount Tactile Button - SMD (6mm) <https://www.sparkfun.com/products/12992> Used on SparkFun Digital Sandbox <https://www.sparkfun.com/products/12651> SMD-RIGHT-ANGLE - Right-angle, surface mount Used on SparkFun Block for Intel® Edison - Arduino <https://www.sparkfun.com/products/13036>; PROD_ID: SWCH-00815; SF_SKU: COM-08229
T2 T16 T21 T26 = monitoring_board:SI7157DP_PMOS: Vishay Siliconix - Si157DP -- P-Channel 20V (D-S) MOSFET; OC_FARNELL: 1412091; OC_NEWARK: unknown
U$4 U$5 U$23 U$48 U$49 U$73 = monitoring_board:MCP33131-05: Microchip -- MCP33131/21/11-XX -- 1Msps/500kSPS 16/14/12-Bit Single-Ended Input SAR ADC Modell: MCP33131-05 -- 500kSPS 16-Bit
U$6 U$8 U$24 U$46 U$47 U$72 = monitoring_board:REF3120-Q1: Texas Instruments REF31xx-Q1 15ppm/°C Maximum, 100-mikroA, SOT-23 Series Voltage Reference Modell: REF3120-Q1
U$11 = monitoring_board:DLP11SN900HL2: Murata (R) Chip Common Mode Choke Coil DLP11SNxxxxL2x-Series Modell: DLP11SN900HL2 Source: https://www.murata.com/en-us/products/productdata/8796756344862/EFLE0004.pdf Source: https://www.murata.com/~/media/webrenewal/support/library/catalog/products/emc/emifil/c35e.ashx
U$12 U$13 U$15 = monitoring_board:BLM21PG221SN1: Murata (R) Chip Ferrite Bead -- BLM21xxxxxxSNx-Series Modell: BLM21PG221SN1 Source: https://www.murata.com/en-us/products/en-us/products/productdata/8796738977822/ENFA0005.pdf Source: https://www.murata.com/~/media/webrenewal/support/library/catalog/products/emc/emifil/c35e.ashx
U$14 = monitoring_board:DUP2201MR6: ON Semiconductor (R) -- ESD Protection Diode -- Low Clamping Voltage TSOP-6 Low Capacitance Diode Surge Protection array 550 watts peak power 6 volts Modell: NUP2201MR6 Source: https://www.onsemi.com/pub/Collateral/NUP2201MR6-D.PDF
U$36 = monitoring_board:BQ24650: Texas Instruments -- bq24650 Synchronous Switch-Mode Battery Charge Controller for Solar Power With Maximum Power Point Tracking
U$37 U$38 U$42 = monitoring_board:SIR404DP_NMOS: Vishay Siliconix SiR404DP -- N-Channel 20V (D-S) MOSFET
U$50 U$51 U$74 = monitoring_board:INA138: Texas Instruments -- INA1x8 High-Side Measurement Current Shunt Monitor Modell: INA139 Input common-mode and pwoer-supply voltages are independent and can range from 2.7V to 36V for the INA 138
U$67 = tsr_1-2433:DEVICE_TSR1-2433: Non-Isolated DC/DC Converter (POL) by Traco Power - TSR 1-2433
U$68 = monitoring_board:NXP_BC847: NXP -- BC847 -- NPN General Purpose Transistors 45V; 100mA
U$69 U$75 U$76 = monitoring_board:NXP_BC857: NXP - BC856; BC857; BC858 -- PNP General Purpose Transistors 65V; 100mA
X1 = con-coax:SMA-: SMA 50 Ohm End Launch Jack Receptacle - Round Contact Johnson Components Source: www.johnsoncomponents.com .. J502-ND.pdf; MF: JOHNSON COMPONENTS; MPN: 142-0701-801; OC_FARNELL: 1608592; OC_NEWARK: 90F2624
X2 = con-berg:PN61729-S: BERG USB connector; OC_FARNELL: unknown; OC_NEWARK: unknown